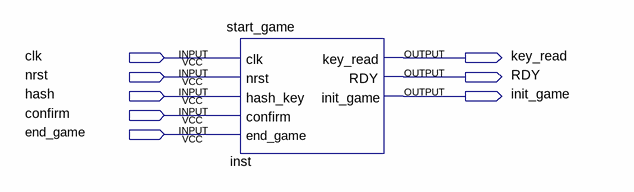
[diagram p0: schematic sheet]
// Quartus schematic start_game_sim.bdf as structural Verilog: 1 symbols, 8 pins
module start_game_sim (
  input  clk,
  input  nrst,
  input  hash,
  input  confirm,
  input  end_game,
  output key_read,
  output RDY,
  output init_game
);

  start_game inst (
    .clk(clk), .nrst(nrst), .hash_key(hash), .confirm(confirm), .end_game(end_game), .key_read(key_read),
    .RDY(RDY), .init_game(init_game));
endmodule
